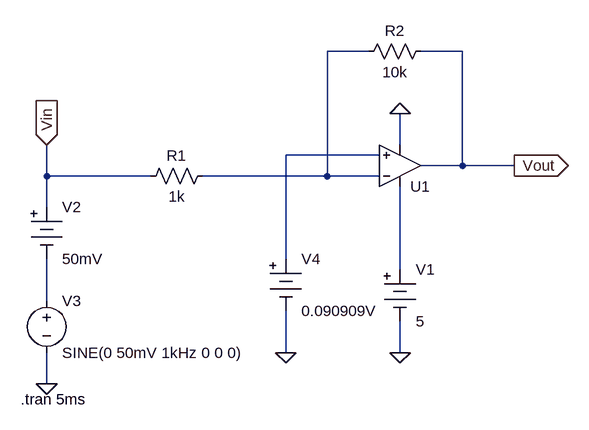
[diagram p0: schematic Inverting Amplifier_Offsetting with Biasing.asc]
Inverting Amplifier_Offsetting with Biasing.asc, the LTspice schematic file:
Version 4
SHEET 1 960 680
WIRE 624 -208 560 -208
WIRE 768 -208 704 -208
WIRE 672 -64 672 -112
WIRE 640 -48 496 -48
WIRE 768 -32 768 -208
WIRE 768 -32 704 -32
WIRE 848 -32 768 -32
WIRE 128 -16 128 -64
WIRE 288 -16 128 -16
WIRE 560 -16 560 -208
WIRE 560 -16 368 -16
WIRE 640 -16 560 -16
WIRE 128 32 128 -16
WIRE 496 112 496 -48
WIRE 672 128 672 0
WIRE 128 176 128 112
WIRE 496 256 496 192
WIRE 672 256 672 208
WIRE 128 304 128 256
FLAG 128 304 0
FLAG 496 256 0
FLAG 672 256 0
FLAG 672 -112 0
FLAG 848 -32 Vout
IOPIN 848 -32 Out
FLAG 128 -64 Vin
IOPIN 128 -64 In
SYMBOL voltage 128 160 R0
WINDOW 123 0 0 Left 0
WINDOW 39 0 0 Left 0
SYMATTR InstName V3
SYMATTR Value SINE(0 50mV 1kHz 0 0 0)
SYMBOL Misc\\battery 128 16 R0
WINDOW 123 0 0 Left 0
WINDOW 39 0 0 Left 0
SYMATTR InstName V2
SYMATTR Value 50mV
SYMBOL res 384 -32 R90
WINDOW 0 0 56 VBottom 2
WINDOW 3 32 56 VTop 2
SYMATTR InstName R1
SYMATTR Value 1k
SYMBOL Misc\\battery 496 96 R0
WINDOW 123 0 0 Left 0
WINDOW 39 0 0 Left 0
SYMATTR InstName V4
SYMATTR Value 0.090909V
SYMBOL Misc\\battery 672 112 R0
SYMATTR InstName V1
SYMATTR Value 5
SYMBOL res 720 -224 R90
WINDOW 0 0 56 VBottom 2
WINDOW 3 32 56 VTop 2
SYMATTR InstName R2
SYMATTR Value 10k
SYMBOL OpAmps\\UniversalOpAmp 672 -32 M180
SYMATTR InstName U1
TEXT 88 328 Left 2 !.tran 5ms

The netlist it stands for:
* Inverting Amplifier_Offsetting with Biasing.asc
V3 N004 0 SINE(0 50mV 1kHz 0 0 0)
V2 Vin N004 50mV
R1 N001 Vin 1k
V4 N002 0 0.090909V
V1 N003 0 5
R2 Vout N001 10k
XU1 N002 N001 N003 0 Vout level1 Avol=1Meg GBW=10Meg Vos=0 En=0 Enk=0 In=0 Ink=0 Rin=500Meg  ; pins In+ In- V+ V- OUT
.tran 5ms
.lib UniversalOpAmp1.lib
.backanno
.end